# Altium project POGO-headers.PrjPcb
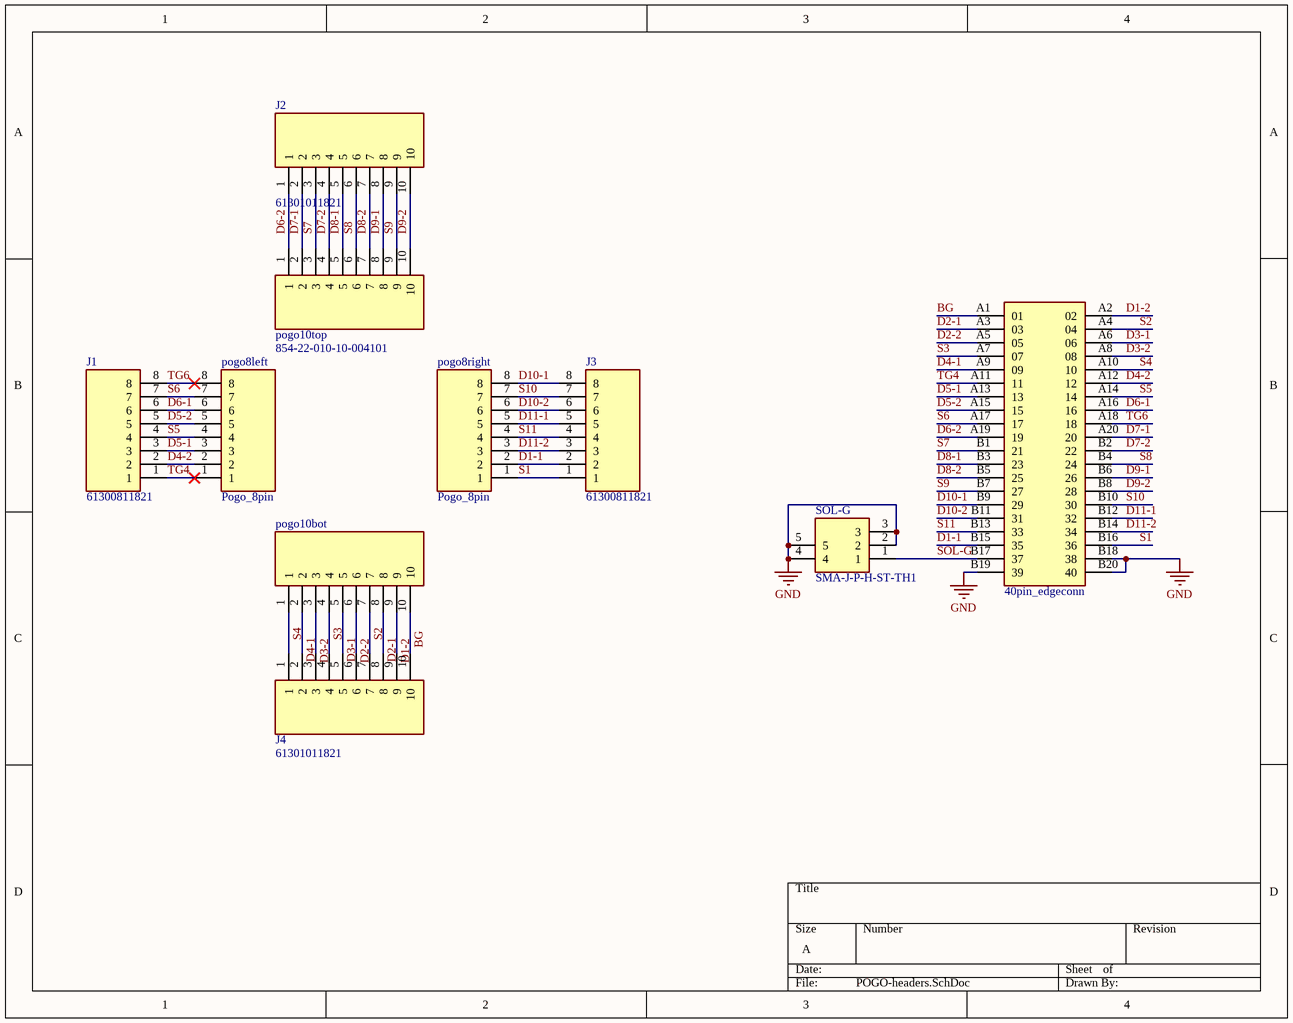
[diagram p0: POGO-headers.SchDoc]
1 sheet, 10 parts. Net scope: global (net labels, ports and power ports of the same name join across sheets).
Board file: POGO-headers.PcbDoc

## Sheet POGO-headers.SchDoc
size A; SheetNumber: 1; SheetTotal: 1

### Parts
CONN  40pin_edgeconn  [Edge Connector]
J1  61300811821  [RHDR8W60P0X254_1X8_2082X250X850P]
J2  61301011821  [RHDR10W60P0X254_1X10_2590X250X850P]
J3  61300811821  [RHDR8W60P0X254_1X8_2082X250X850P]
J4  61301011821  [RHDR10W60P0X254_1X10_2590X250X850P]
pogo8left  Pogo_8pin  [New footprint 1]
pogo8right  Pogo_8pin  [New footprint 1]
pogo10bot  854-22-010-10-004101  [8542201010004101]  (value not drawn)
pogo10top  854-22-010-10-004101  [8542201010004101]
SOL-G  SMA-J-P-H-ST-TH1  [SMAJPHSTTH1]

### Nets
GND: CONN.B18(38) CONN.B19(39) CONN.B20(40) SOL-G.2 SOL-G.3 SOL-G.4 SOL-G.5
BG: CONN.A1(01) J4.10 pogo10bot.10
D1-1: CONN.B15(35) J3.2 pogo8right.2
D1-2: CONN.A2(02) J4.9 pogo10bot.9
D2-1: CONN.A3(03) J4.8 pogo10bot.8
D2-2: CONN.A5(05) J4.6 pogo10bot.6
D3-1: CONN.A6(06) J4.5 pogo10bot.5
D3-2: CONN.A8(08) J4.3 pogo10bot.3
D4-1: CONN.A9(09) J4.2 pogo10bot.2
D4-2: CONN.A12(12) J1.2 pogo8left.2
D5-1: CONN.A13(13) J1.3 pogo8left.3
D5-2: CONN.A15(15) J1.5 pogo8left.5
D6-1: CONN.A16(16) J1.6 pogo8left.6
D6-2: CONN.A19(19) J2.1 pogo10top.1
D7-1: CONN.A20(20) J2.2 pogo10top.2
D7-2: CONN.B2(22) J2.4 pogo10top.4
D8-1: CONN.B3(23) J2.5 pogo10top.5
D8-2: CONN.B5(25) J2.7 pogo10top.7
D9-1: CONN.B6(26) J2.8 pogo10top.8
D9-2: CONN.B8(28) J2.10 pogo10top.10
D10-1: CONN.B9(29) J3.8 pogo8right.8
D10-2: CONN.B11(31) J3.6 pogo8right.6
D11-1: CONN.B12(32) J3.5 pogo8right.5
D11-2: CONN.B14(34) J3.3 pogo8right.3
S1: CONN.B16(36) J3.1 pogo8right.1
S2: CONN.A4(04) J4.7 pogo10bot.7
S3: CONN.A7(07) J4.4 pogo10bot.4
S4: CONN.A10(10) J4.1 pogo10bot.1
S5: CONN.A14(14) J1.4 pogo8left.4
S6: CONN.A17(17) J1.7 pogo8left.7
S7: CONN.B1(21) J2.3 pogo10top.3
S8: CONN.B4(24) J2.6 pogo10top.6
S9: CONN.B7(27) J2.9 pogo10top.9
S10: CONN.B10(30) J3.7 pogo8right.7
S11: CONN.B13(33) J3.4 pogo8right.4
SOL-G: CONN.B17(37) SOL-G.1
TG4: CONN.A11(11) J1.1 pogo8left.1
TG6: CONN.A18(18) J1.8 pogo8left.8

### Library data of the parts
CONN = CMP-002-00082-6
J1 J3 = 61300811821: Connector; Manufacturer_Name: Wurth Elektronik; Datasheet Link: https://www.we-online.com/catalog/datasheet/61300811821.pdf; Height: 8.5mm; Manufacturer_Part_Number: 61300811821; Mouser Part Number: 710-61300811821; Mouser Price/Stock: https://www.mouser.co.uk/ProductDetail/Wurth-Elektronik/61300811821?qs=ulEaXIWI0c%252BOxrSqc7jVmQ%3D%3D
J2 J4 = 61301011821: Connector; Manufacturer_Name: Wurth Elektronik; Datasheet Link: http://katalog.we-online.de/em/datasheet/6130xx11821.pdf; Height: 8.5mm; Manufacturer_Part_Number: 61301011821; Mouser Part Number: 710-61301011821; Mouser Price/Stock: https://www.mouser.co.uk/ProductDetail/Wurth-Elektronik/61301011821?qs=W%252B2sBeLta1ZhlLR0YCzonQ%3D%3D
pogo8left pogo8right = CMP-002-00071-1: 8-pin pogo pin
pogo10bot pogo10top = 854-22-010-10-004101: Connector; Manufacturer_Name: Mill-Max; Datasheet Link: https://www.mill-max.com/products/spring-loaded/pogo-pin-header-strip/854/10-004101/854-22-010-10-004101?s_term=854-22-010-10-004101&s_type=Quick/Product/Part%20Number%20Search; Height: 4.35mm; Manufacturer_Part_Number: 854-22-010-10-004101; Mouser Part Number: 575-8542201010004101; Mouser Price/Stock: https://www.mouser.co.uk/ProductDetail/Mill-Max/854-22-010-10-004101?qs=t7xnP681wgUW5migVjrAuw%3D%3D
SOL-G = SMA-J-P-H-ST-TH1: Connector; Manufacturer_Name: SAMTEC; Datasheet Link: http://suddendocs.samtec.com/prints/sma-j-p-x-st-th1-mkt.pdf; Height: 9.55mm; Manufacturer_Part_Number: SMA-J-P-H-ST-TH1; Mouser Part Number: 200-SMAJPHSTTH1; Mouser Price/Stock: https://www.mouser.co.uk/ProductDetail/Samtec/SMA-J-P-H-ST-TH1?qs=bkXRl3BLxbHdaAB2Qwy6zw%3D%3D; Arrow Part Number: SMA-J-P-H-ST-TH1; Arrow Price/Stock: https://www.arrow.com/en/products/sma-j-p-h-st-th1/samtec?region=europe